# Altium schematic sheet LCD Display.SchDoc: LCD Display
size A4; Date: Dec. 29th, 2022; Author: Karl Asseily; DrawnBy: Karl Asseily; DocumentNumber: 202301140903; Revision: 1.2; SheetNumber: 18; SheetTotal: 20; Time: 23:00
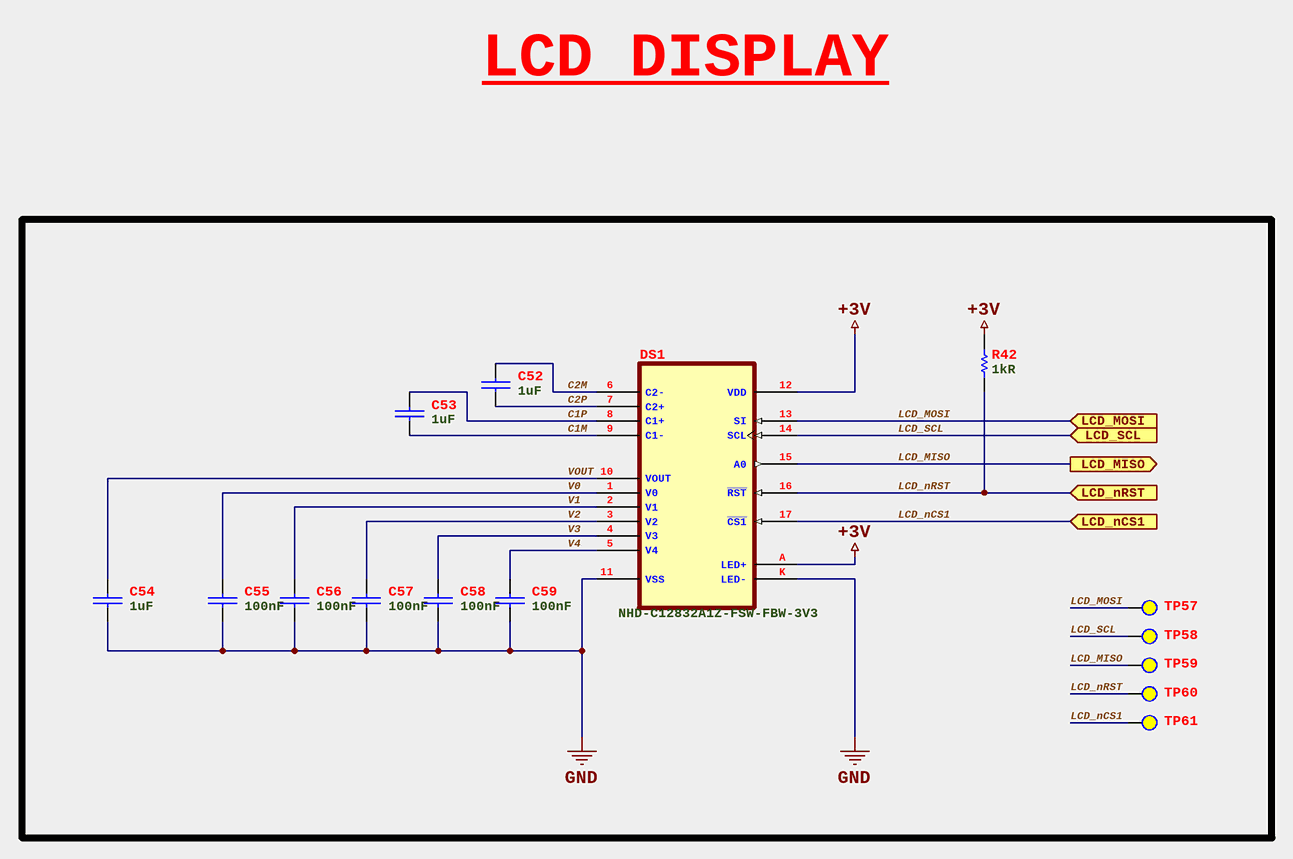
[diagram p0: LCD Display.SchDoc]

## Parts
C52  1uF  [CAP_0805]
C53  1uF  [CAP_0805]
C54  1uF  [CAP_0805]
C55  100nF  [CAP_0603]
C56  100nF  [CAP_0603]
C57  100nF  [CAP_0603]
C58  100nF  [CAP_0603]
C59  100nF  [CAP_0603]
DS1  NHD-C12832A1Z-FSW-FBW-3V3  [LCD_NHD-C12832A1Z-FSW-FBW-3V3]
R42  1kR  [RES_0603]
TP57  LCD_MOSI  [TEST POINT PAD]  (value not drawn)  (no BOM)
TP58  LCD_SCL  [TEST POINT PAD]  (value not drawn)  (no BOM)
TP59  LCD_MISO  [TEST POINT PAD]  (value not drawn)  (no BOM)
TP60  LCD_nRST  [TEST POINT PAD]  (value not drawn)  (no BOM)
TP61  LCD_nCS1  [TEST POINT PAD]  (value not drawn)  (no BOM)

## Ports
LCD_MISO (out, see Cellar Watchdog, ESP32 Processor, Main Controller Unit), LCD_MOSI (in, see Cellar Watchdog, ESP32 Processor, Main Controller Unit), LCD_nCS1 (in, see Cellar Watchdog, ESP32 Processor, Main Controller Unit), LCD_nRST (in, see Cellar Watchdog, ESP32 Processor, Main Controller Unit), LCD_SCL (in, see Cellar Watchdog, ESP32 Processor, Main Controller Unit)

## Nets
+3V: DS1.12(VDD) DS1.A(LED+) R42.2
GND: C54.2 C55.2 C56.2 C57.2 C58.2 C59.2 DS1.11(VSS) DS1.K(LED-)
C1M: C53.2 DS1.9(C1-)
C1P: C53.1 DS1.8(C1+)
C2M: C52.1 DS1.6(C2-)
C2P: C52.2 DS1.7(C2+)
LCD_MISO: DS1.15(A0) TP59.TP ; port LCD_MISO
LCD_MOSI: DS1.13(SI) TP57.TP ; port LCD_MOSI
LCD_nCS1: DS1.17(~{CS1}) TP61.TP ; port LCD_nCS1
LCD_nRST: DS1.16(~{RST}) R42.1 TP60.TP ; port LCD_nRST
LCD_SCL: DS1.14(SCL) TP58.TP ; port LCD_SCL
V0: C55.1 DS1.1(V0)
V1: C56.1 DS1.2(V1)
V2: C57.1 DS1.3(V2)
V3: C58.1 DS1.4(V3)
V4: C59.1 DS1.5(V4)
VOUT: C54.1 DS1.10(VOUT)

## Notes on the sheet
- LCD DISPLAY
- Project
- Sheet
- Size
- Filename
- A4
- of
- Number
- Drawn By
- Rev.
- Variant
- Date

## Library data of the parts
C52-C54 = CAP_1uF-16V-10%_0603: 1 µF ±10% 16V Ceramic Capacitor X7R 0603 (1608 Metric); Manufacturer: Yageo; Manufacturer Part Number: CC0603KRX7R7BB105; Dissipation Factor: 5%; Supplier 1: Digi-Key; RoHS: Yes; Category: Ceramic Capacitors; Stock 1: 10491943; Pricing 1: 1=0.14000, 10=0.09800, 50=0.05560, 100=0.04610, 500=0.03234, 1000=0.02678 (USD); Mounting Technology: Surface Mount; Case/Package: 0603; Pins: 2; Case Code (Metric): 1608; Case Code (Imperial): 0603; Min Operating Temperature: -55°C; Max Operating Temperature: 125°C; Capacitance: 1uF; Tolerance: 10%; Dielectric: X7R; Voltage Rating: 16V; Package Quantity: 1; Packaging: Tape and Reel; Voltage Rating (DC): 16V; Termination: SMD/SMT; Resistor Type: Ceramic; Voltage: 16V; Series: CC; Construction: Flat; Length: 1.6mm; Width: 0.031inch; Height: 0.8mm; Thickness: 0.035inch; Depth: 0.8mm; Radiation Hardening: No; Lead Free: Lead Free; Halogen Free: Halogen Free; RoHS Compliant: Yes; ComponentLink1URL: C:\Users\Public\Documents\Altium\Projects\Cellar_Watchdog\Docs\Capacitor\UPY-GPHC_X7R_6.3V-to-250V_22.pdf; ComponentLink1Description: Datasheet; Supplier 2: Mouser; Supplier Part Number 1: 311-1446-1-ND; Supplier Part Number 2: 603-CC603KRX7R7BB105
C55-C59 = CAP_0.1uF-50V-10%_0603: 0.1 µF ±10% 50V Ceramic Capacitor X7R 0603 (1608 Metric); Manufacturer: Yageo; Manufacturer Part Number: CC0603KRX7R9BB104; Supplier 1: Digi-Key; RoHS: Yes; Category: Ceramic Capacitors; Stock 1: 10054527; Pricing 1: 1=0.10000, 10=0.05400, 50=0.02960, 100=0.02430, 500=0.01732, 1000=0.01361 (USD); Mounting Technology: Surface Mount; Case/Package: 0603; Pins: 2; Case Code (Metric): 1608; Case Code (Imperial): 0603; Dielectric Material: Ceramic; Min Operating Temperature: -55°C; Max Operating Temperature: 125°C; Package Quantity: 1; Capacitance: 100nF; Voltage Rating: 50V; Tolerance: 10%; Packaging: Tape and Reel; Dielectric: X7R; Termination: SMD/SMT; Voltage: 50V; Series: CC; Length: 0.063inch; Width: 0.031inch; Height: 0.8mm; Thickness: 0.035inch; Depth: 0.8mm; Radiation Hardening: No; Reach SVHC Compliant: Yes; Lead Free: Lead Free; Halogen Free: Halogen Free; RoHS Compliant: Yes; ComponentLink1URL: C:\Users\Public\Documents\Altium\Projects\Cellar_Watchdog\Docs\Capacitor\UPY-GPHC_X7R_6.3V-to-250V_22.pdf; ComponentLink1Description: Datasheet; Supplier Part Number 2: 603-CC603KRX7R9BB104; Supplier Part Number 1: 311-1344-1-ND; Supplier 2: Mouser
DS1 = LCD_NHD-C12832A1Z-FSW-FBW-3V3: Graphic LCD Display Module Transflective Black (White - Inverted) FSTN - Film Super-Twisted Nematic SPI 128 x 32; Manufacturer: Newhaven Display; Contrast Ratio: 6:1; Backlight Type: LED; Touchscreen: No; Resolution (height): 32pixel; Resolution (width): 128pixel; Supplier 1: Digi-Key; Manufacturer Part Number: NHD-C12832A1Z-FSW-FBW-3V3; RoHS: Yes; Category: LCD, OLED, Graphic Displays; Stock 1: 5801; Pricing 1: 1=12.78000, 5=12.01600, 10=11.24800, 50=10.60900, 100=10.09780, 250=9.58656, 500=9.20310 (USD); Mount: Through Hole; Number of Pins: 17; Min Operating Temperature: -20°C; Max Operating Temperature: 70°C; Background Color: Black; Packaging: Bulk; Package Quantity: 100; Interface: SPI; Supplier 2: Mouser; Supplier Part Number 2: 763-C12832A1ZFSWFBW3; Supplier Part Number 1: NHD-C12832A1Z-FSW-FBW-3V3-ND; ComponentLink2Description: Datasheet; ComponentLink2URL: C:\Users\Public\Documents\Altium\Projects\Cellar_Watchdog\Docs\LCD Display\NHD-C12832A1Z-FSW-FBW-3V3.pdf; ComponentLink3Description: Controller Datasheet; ComponentLink3URL: C:\Users\Public\Documents\Altium\Projects\Cellar_Watchdog\Docs\LCD Display\ST7565R.pdf
R42 = RES_1kR-100mW-1%_0603: 1 kOhms ±1% 0.1W, 1/10W Chip Resistor 0603 (1608 Metric) Moisture Resistant Thick Film; Manufacturer: Yageo; Manufacturer Part Number: RC0603FR-071KL; Temperature Coefficient: 100ppm/°C; Power Rating: 100mW; Voltage Rating: 50V; Supplier 1: Digi-Key; RoHS: Yes; Category: Chip SMD Resistors; Stock 1: 31324809; Pricing 1: 1=0.10000, 10=0.02100, 100=0.00850, 1000=0.00383, 2500=0.00332 (USD); Case/Package: 0603; Contact Plating: Tin,Matte; Case Code (Imperial): 0603; Case Code (Metric): 1608; Min Operating Temperature: -55°C; Max Operating Temperature: 155°C; Tolerance: 1%; Resistance: 1kR; Resistor Type: Thick Film; Packaging: Tape and Reel; Termination: SMD/SMT; Features: Moisture Resistant; Series: RC; Max Power Dissipation: 100mW; Number of Terminations: 2; Technology: THICK FILM; Resistance Tolerance: 1%; Construction: Rectangular; Length: 1.6mm; Height: 0.45mm; Depth: 0.8mm; Radiation Hardening: No; Reach SVHC Compliant: Yes; Lead Free: Lead Free; Military Standard: Not; RoHS Compliant: Yes; Supplier 2: Mouser; Supplier Part Number 2: 603-RC0603FR-071KL; Supplier Part Number 1: 311-1.00KHRCT-ND; ComponentLink1Description: Datasheet; ComponentLink1URL: C:\Users\Public\Documents\Altium\Projects\Cellar_Watchdog\Docs\Resistor\PYu-RC_Group_51_RoHS_L_12.pdf
TP57-TP61 = Test Point: PCB Test Point; ClassName: Test Point
  TP57: Value: LCD_MOSI
  TP58: Value: LCD_SCL
  TP59: Value: LCD_MISO
  TP60: Value: LCD_nRST
  TP61: Value: LCD_nCS1